# EAGLE schematic SCFschem (EAGLE 8.3.1)
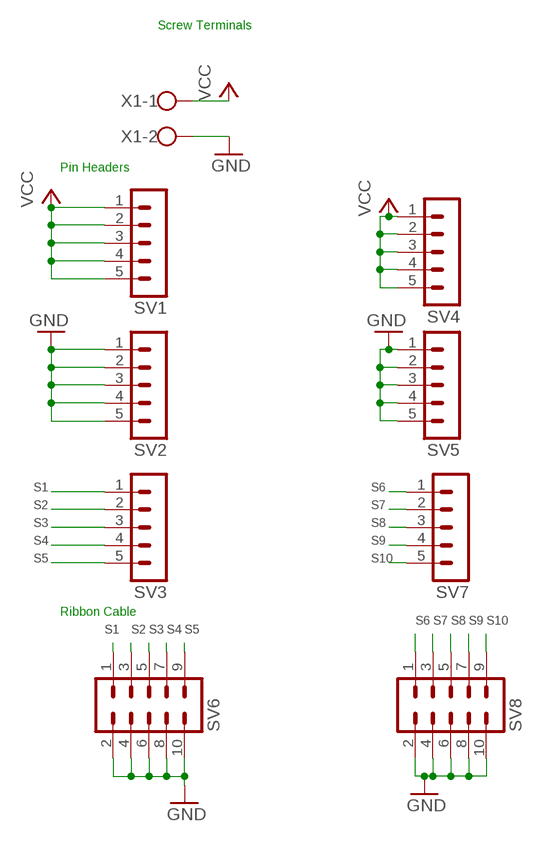
[diagram p0: schematic, sheet 1]

## Parts
SV1  MA05-1  [MA05-1]
SV2  MA05-1  [MA05-1]
SV3  MA05-1  [MA05-1]
SV4  MA05-1  [MA05-1]
SV5  MA05-1  [MA05-1]
SV6  MA05-2  [MA05-2]
SV7  MA05-1  [MA05-1]
SV8  MA05-2  [MA05-2]
X1  1X02_5MM_SCREW  [W237-102]

## Nets
GND: SV2.1 SV2.2 SV2.3 SV2.4 SV2.5 SV5.1 SV5.2 SV5.3 SV5.4 SV5.5 SV6.2 SV6.4 SV6.6 SV6.8 SV6.10 SV8.2 SV8.4 SV8.6 SV8.8 SV8.10 X1.2
S1: SV3.1 SV6.1
S2: SV3.2 SV6.3
S3: SV3.3 SV6.5
S4: SV3.4 SV6.7
S5: SV3.5 SV6.9
S6: SV7.1 SV8.1
S7: SV7.2 SV8.3
S8: SV7.3 SV8.5
S9: SV7.4 SV8.7
S10: SV7.5 SV8.9
VCC: SV1.1 SV1.2 SV1.3 SV1.4 SV1.5 SV4.1 SV4.2 SV4.3 SV4.4 SV4.5 X1.1

## Notes on the sheet
- Screw Terminals
- Pin Headers
- Ribbon Cable

## Library data of the parts
SV1-SV5 SV7 = con-lstb:MA05-1: PIN HEADER; OC_FARNELL: unknown; OC_NEWARK: unknown
SV6 SV8 = con-lstb:MA05-2: PIN HEADER; OC_FARNELL: unknown; OC_NEWARK: unknown
X1 = ECE388:1X02_5MM_SCREW: WAGO SCREW CLAMP; MPN: 237-102; OC_FARNELL: unknown; OC_NEWARK: 70K9898